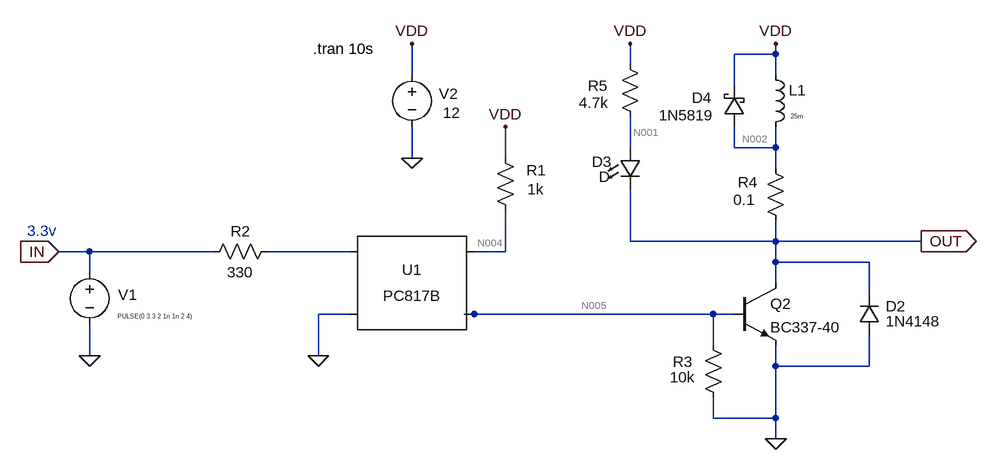
[diagram p0: schematic v1.0.asc]
v1.0.asc, the LTspice schematic file:
Version 4.1
SHEET 1 1332 680
WIRE 784 -176 784 -192
WIRE 784 -176 720 -176
WIRE 560 -160 560 -192
WIRE 224 -144 224 -192
WIRE 784 -144 784 -176
WIRE 720 -128 720 -176
WIRE 560 -32 560 -80
WIRE 720 -32 720 -64
WIRE 784 -32 784 -64
WIRE 784 -32 720 -32
WIRE 224 -16 224 -64
WIRE 368 -16 368 -64
WIRE 784 0 784 -32
WIRE 560 112 560 32
WIRE 784 112 784 80
WIRE 784 112 560 112
WIRE 1008 112 784 112
WIRE -272 128 -320 128
WIRE -80 128 -272 128
WIRE 128 128 0 128
WIRE 368 128 368 64
WIRE 368 128 320 128
WIRE 784 144 784 112
WIRE 928 144 784 144
WIRE -272 160 -272 128
WIRE 784 176 784 144
WIRE 928 192 928 144
WIRE 128 224 80 224
WIRE 320 224 304 224
WIRE 688 224 320 224
WIRE 720 224 688 224
WIRE 688 272 688 224
WIRE -272 288 -272 240
WIRE 80 288 80 224
WIRE 784 304 784 272
WIRE 928 304 928 256
WIRE 928 304 784 304
WIRE 688 384 688 352
WIRE 784 384 784 304
WIRE 784 384 688 384
WIRE 784 416 784 384
FLAG 80 288 0
FLAG -272 288 0
FLAG 224 -16 0
FLAG -320 128 IN
IOPIN -320 128 In
FLAG 784 416 0
FLAG 224 -192 VDD
FLAG 368 -64 VDD
FLAG 784 -192 VDD
FLAG 1008 112 OUT
IOPIN 1008 112 Out
FLAG 560 -192 VDD
SYMBOL Optos\\PC817B 224 176 R0
SYMATTR InstName U1
SYMBOL res 352 -32 R0
WINDOW 0 48 35 Left 2
WINDOW 3 50 64 Left 2
SYMATTR InstName R1
SYMATTR Value 1k
SYMBOL voltage -272 144 R0
WINDOW 123 0 0 Left 0
WINDOW 39 0 0 Left 0
WINDOW 0 44 50 Left 2
WINDOW 3 43 83 Left 0
SYMATTR InstName V1
SYMATTR Value PULSE(0 3.3 2 1n 1n 2 4)
SYMBOL res 16 112 R90
WINDOW 0 0 56 VBottom 2
WINDOW 3 32 56 VTop 2
SYMATTR InstName R2
SYMATTR Value 330
SYMBOL voltage 224 -160 R0
WINDOW 123 0 0 Left 0
WINDOW 39 0 0 Left 0
WINDOW 0 42 45 Left 2
WINDOW 3 48 74 Left 2
SYMATTR InstName V2
SYMATTR Value 12
SYMBOL npn 720 176 R0
SYMATTR InstName Q2
SYMATTR Value BC337-40
SYMBOL res 672 256 R0
WINDOW 0 -46 41 Left 2
WINDOW 3 -51 65 Left 2
SYMATTR InstName R3
SYMATTR Value 10k
SYMBOL ind 768 -160 R0
WINDOW 3 39 80 Left 0
SYMATTR InstName L1
SYMATTR Value 25m
SYMATTR SpiceLine Rser=100
SYMBOL res 768 -16 R0
WINDOW 0 -42 37 Left 2
WINDOW 3 -49 64 Left 2
SYMATTR InstName R4
SYMATTR Value 0.1
SYMBOL diode 944 256 R180
WINDOW 0 -40 44 Left 2
WINDOW 3 -94 21 Left 2
SYMATTR InstName D2
SYMATTR Value 1N4148
SYMBOL LED 544 -32 R0
WINDOW 0 -43 22 Left 2
WINDOW 3 -32 45 Left 2
SYMATTR InstName D3
SYMBOL res 544 -176 R0
WINDOW 0 -49 49 Left 2
WINDOW 3 -63 75 Left 2
SYMATTR InstName R5
SYMATTR Value 4.7k
SYMBOL schottky 736 -64 R180
WINDOW 0 50 45 Left 2
WINDOW 3 47 18 Left 2
SYMATTR InstName D4
SYMATTR Value 1N5819
TEXT 72 -184 Left 2 !.tran 10s
TEXT -368 96 Left 2 ;3.3v

The netlist it stands for:
* v1.0.asc
X§U1 N003 0 N004 N005 PC817 Igain=1.5m
R1 VDD N004 1k
V1 IN 0 PULSE(0 3.3 2 1n 1n 2 4)
R2 N003 IN 330
V2 VDD 0 12
Q2 OUT N005 0 0 BC337-40
R3 N005 0 10k
L1 VDD N002 25m Rser=100
R4 N002 OUT 0.1
D2 0 OUT 1N4148
D3 N001 OUT D
R5 VDD N001 4.7k
D4 N002 VDD 1N5819
.model D D
.lib standard.dio
.model NPN NPN
.model PNP PNP
.lib standard.bjt
.tran 10s
* 3.3v
.lib PC817.sub
.backanno
.end

* Results of the author's LTspice run, read from the files saved beside the schematic
* Operating Point, zero values left out:
*   V(n001) = 12 V
*   V(n002) = 12 V
*   V(n004) = 12 V
*   V(n005) = 609.4 nV
*   V(out) = 12 V
*   V(vdd) = 12 V
*   I(D2) = -2.532 nA
*   I(D4) = -208.5 pA
*   I(L1) = 2.336 nA
*   I(R1) = 48.87 pA
*   I(R3) = 60.94 pA
*   I(R4) = 2.544 nA
*   I(V2) = -2.593 nA
*   Ib(Q2) = -12.07 pA
*   Ic(Q2) = 12.16 pA
*   Ix(u1:3) = 48.87 pA
*   Ix(u1:4) = -48.87 pA
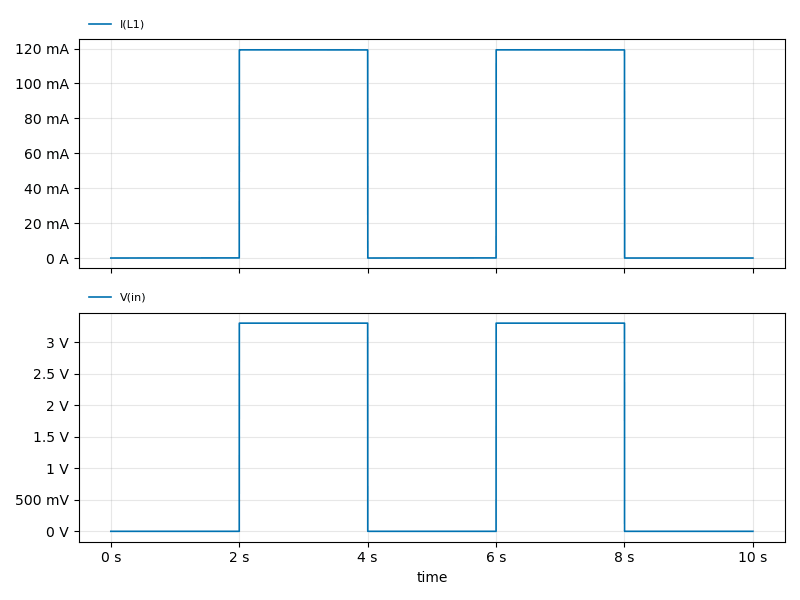
[diagram p1: Transient Analysis of v1.0.asc, plotted from the saved traces]
* Transient Analysis, 1 run:
*   I(L1): min -43.23 nA, max 119.2 mA, average 47.69 mA, rms 75.4 mA, last 0 A
*   V(in): min 0 V, max 3.3 V, average 1.32 V, rms 2.087 V, last 0 V